# Altium project FEEL-Lora-STM32-Road-datalogger.PrjPcb
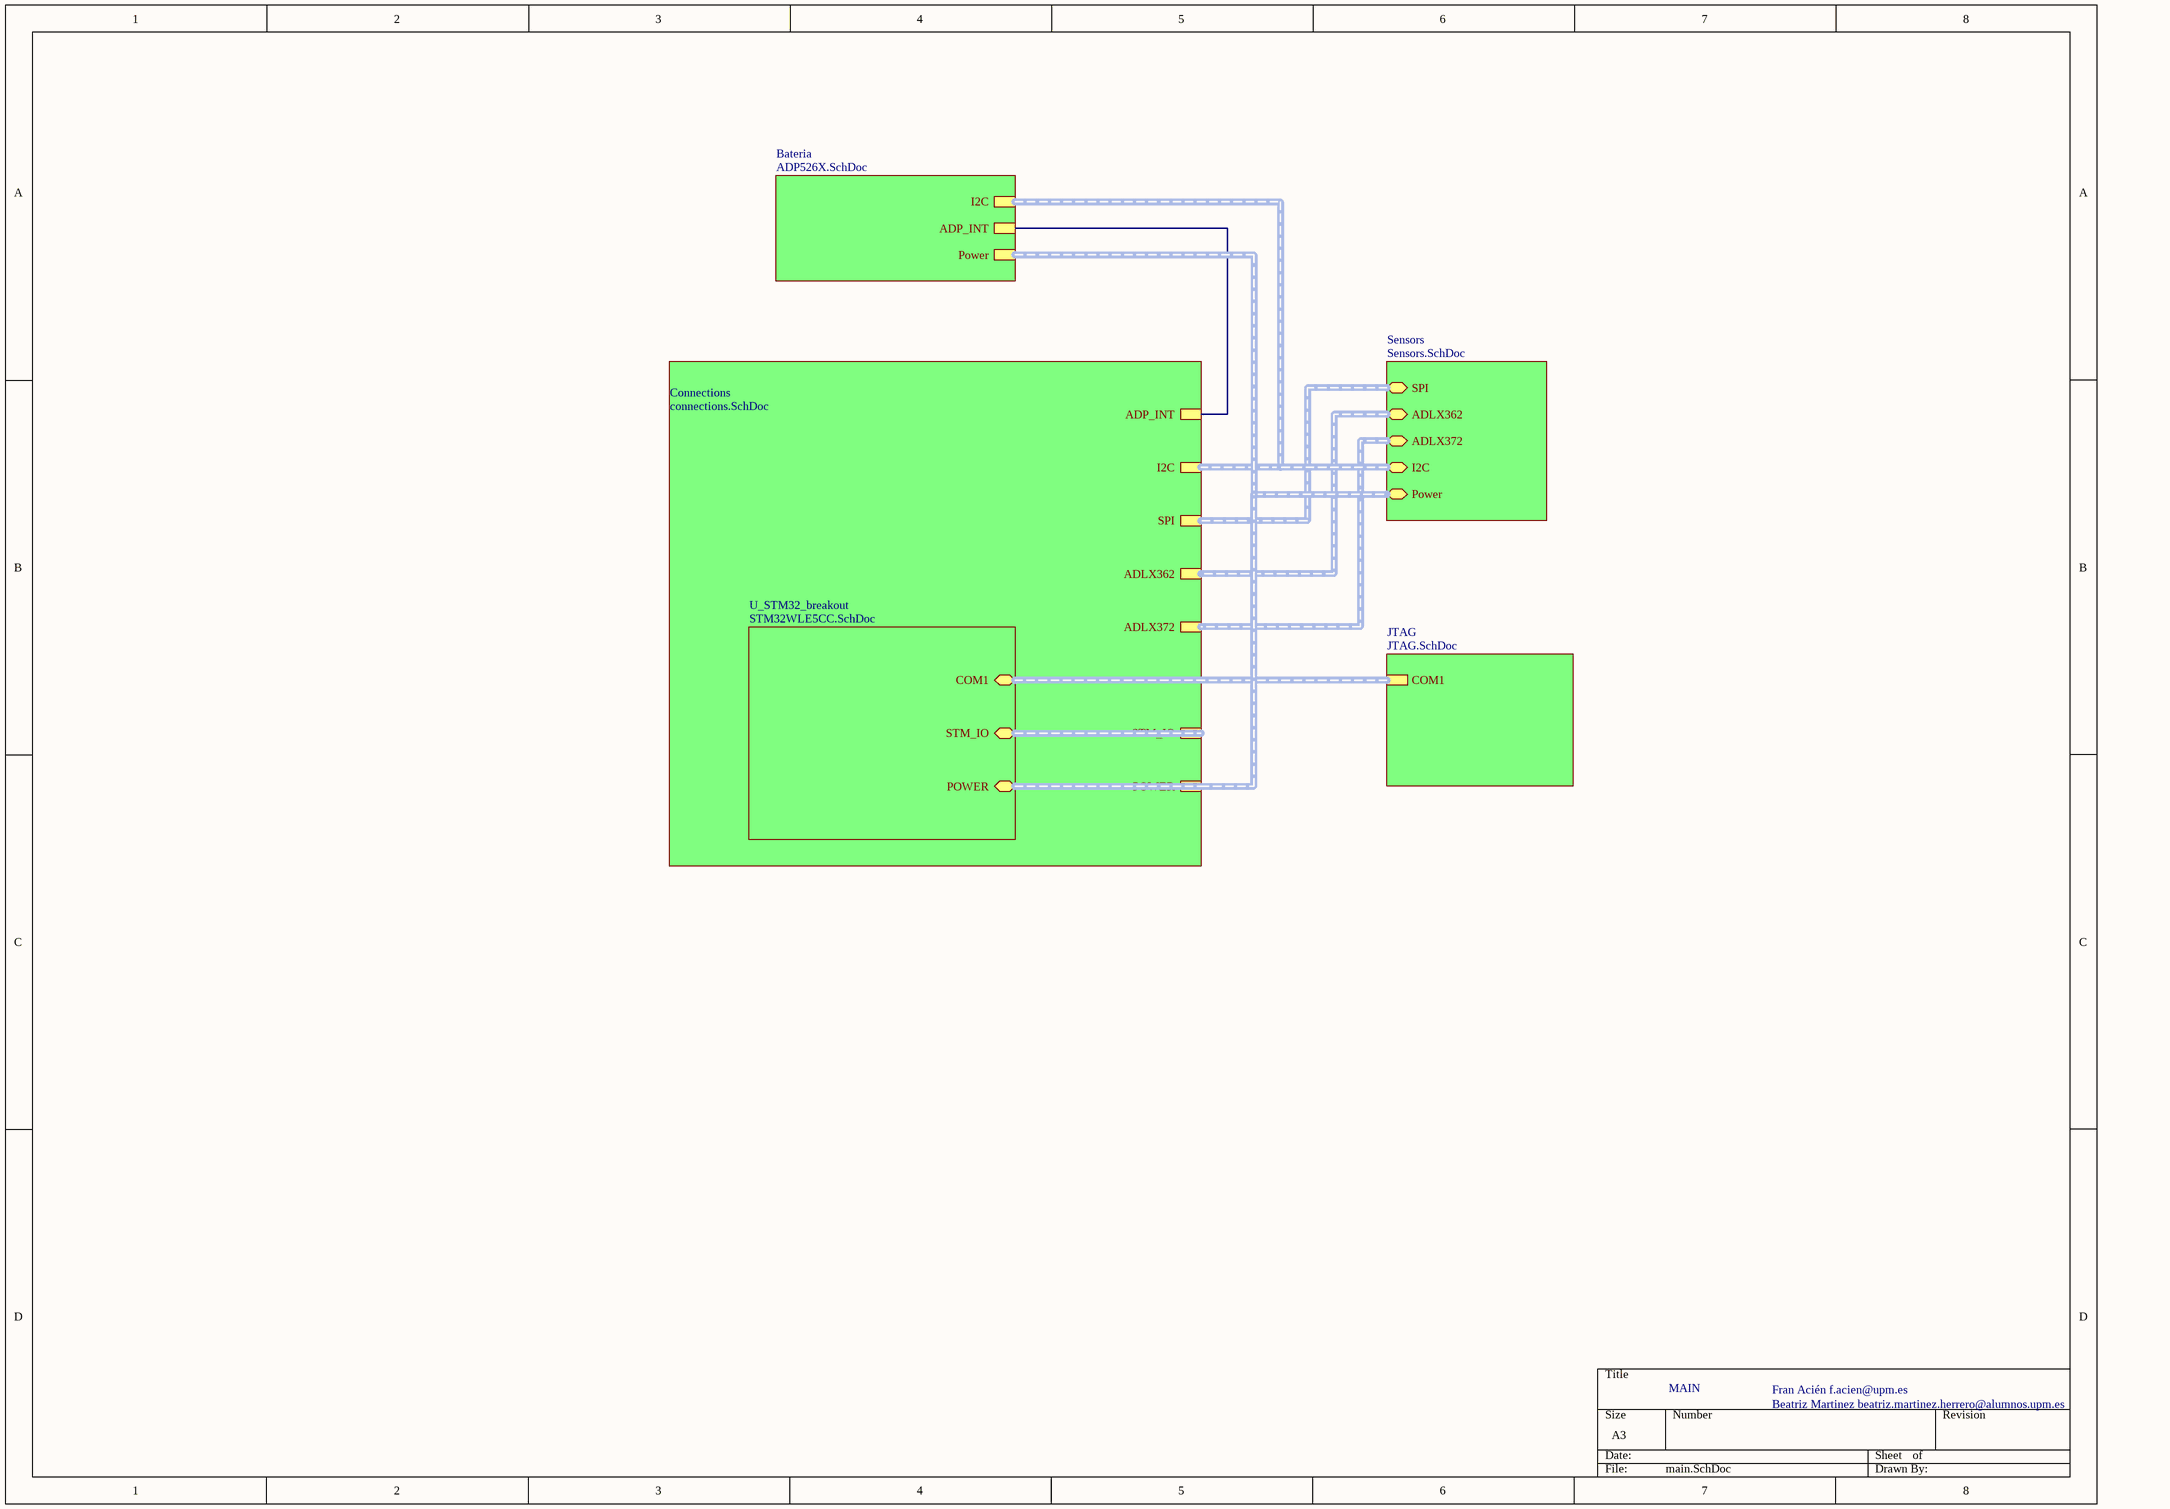
[diagram p0: main.SchDoc]
6 sheets, 77 parts. Net scope: hierarchical (ports join the sheet entries above them; power ports are global).
Board file: FOOTPRINT.PcbDoc
Sheets:
  main.SchDoc
    Connections = connections.SchDoc
    U_STM32_breakout = STM32WLE5CC.SchDoc
    Sensors = Sensors.SchDoc
    JTAG = JTAG.SchDoc
    Bateria = ADP526X.SchDoc

## Sheet main.SchDoc
size A3

### Sub-sheets
Bateria = ADP526X.SchDoc: I2C (harness I2C), Power (harness Power), ADP_INT
Connections = connections.SchDoc: I2C (harness I2C), SPI (harness SPI), ADLX362 (harness ADLX362), ADLX372 (harness ADLX372), STM_IO, POWER (harness Power), ADP_INT
JTAG = JTAG.SchDoc: COM1 (harness SWD)
Sensors = Sensors.SchDoc: SPI (bidir, harness SPI), ADLX362 (bidir, harness ADLX362), ADLX372 (bidir, harness ADLX372), I2C (bidir, harness BME680), Power (bidir, harness Power)
U_STM32_breakout = STM32WLE5CC.SchDoc: STM_IO (bidir, harness IO), COM1 (bidir, harness SWD), POWER (bidir, harness Power)

### Nets
ADP_INT: sheet Connections/ADP_INT, sheet Bateria/ADP_INT

### Buses and harness runs
harness sheet Bateria/I2C = sheet Connections/I2C = sheet Sensors/I2C
harness sheet Bateria/Power = sheet Connections/POWER = sheet Sensors/Power = sheet U_STM32_breakout/POWER
harness sheet Connections/ADLX362 = sheet Sensors/ADLX362
harness sheet Connections/ADLX372 = sheet Sensors/ADLX372
harness sheet Connections/SPI = sheet Sensors/SPI
harness sheet Connections/STM_IO = sheet U_STM32_breakout/STM_IO
harness sheet JTAG/COM1 = sheet U_STM32_breakout/COM1

### Notes on the sheet
- MAIN
- Fran Acién f.acien@upm.es
- Beatriz Martinez beatriz.martinez.herrero@alumnos.upm.es

## Sheet connections.SchDoc
size A4
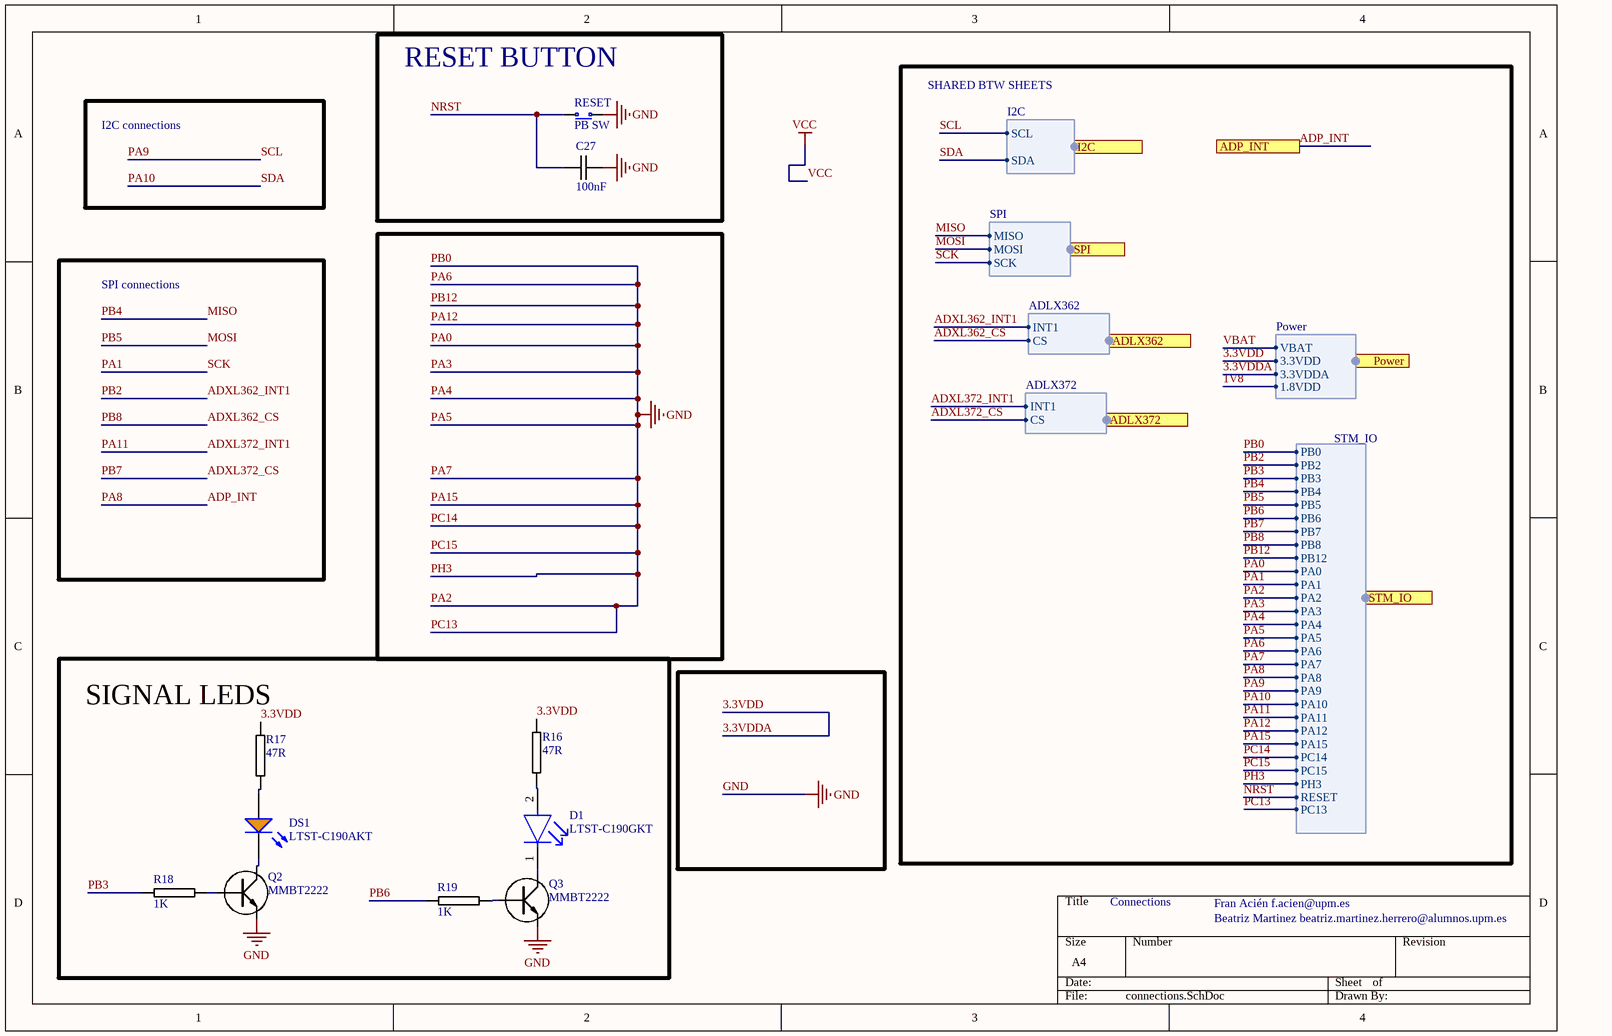
[diagram p1: connections.SchDoc]

### Parts
C27  100nF  [0603C-GENERIC]
D1  LTST-C190GKT  [FP-LTST-C190GKT-MFG]
DS1  LTST-C190AKT  [LTST-C190AKT-2_V]
Q2  MMBT2222  [SOT23-BCE]
Q3  MMBT2222  [SOT23-BCE]
R16  47R  [0603R-47]
R17  47R  [0603R-47]
R18  1K  [0603R-1k]
R19  1K  [0603R-1k]
RESET  PB SW  [Switch-PB-6.2x6.3mm-SMD]

### Blocks framed on the sheet
RESET BUTTON: C27 RESET
SIGNAL LEDS: D1 DS1 Q2 Q3 R16-R19

### Ports
ADLX362 (harness ADLX362), ADLX372 (harness ADLX372), ADP_INT, I2C (harness I2C), Power (harness Power), SPI (harness SPI), STM_IO (harness STM_IO)

### Harnesses
Power: VBAT, 3.3VDD, 3.3VDDA, 1.8VDD
SPI: MISO, MOSI, SCK
I2C: SCL, SDA
STM_IO: PB2, PB3, PB4, PB5, PB6, PB7, PB8, PB12, PA0, PA1, PA2, PA3, PA4, PA5, PA6, PA7, PA8, PA9, PA10, PA11, PA12, PA15, PC14, PC15, PB0, PH3, RESET, PC13
ADLX372: INT1, CS
ADLX362: INT1, CS

### Nets
3.3VDD: R16.1 R17.2 ; port Power.3.3VDD, port Power.3.3VDDA  [also labelled 3.3VDDA]
GND: C27.2 Q2.E Q3.E RESET.2(COM) ; port STM_IO.PB12, port STM_IO.PA0, port STM_IO.PA2, port STM_IO.PA3, port STM_IO.PA4, port STM_IO.PA5, port STM_IO.PA6, port STM_IO.PA7, port STM_IO.PA12, port STM_IO.PA15, port STM_IO.PC14, port STM_IO.PC15, port STM_IO.PB0, port STM_IO.PH3, port STM_IO.PC13  [also labelled PA0, PA12, PA15, PA2, PA3, PA4, PA5, PA6, PA7, PB0, PB12, PC13, PC14, PC15, PH3]
ADP_INT: port ADP_INT, port STM_IO.PA8  [also labelled PA8]
ADXL362_CS: port STM_IO.PB8, port ADLX362.CS  [also labelled PB8]
ADXL362_INT1: port STM_IO.PB2, port ADLX362.INT1  [also labelled PB2]
ADXL372_CS: port STM_IO.PB7, port ADLX372.CS  [also labelled PB7]
ADXL372_INT1: port STM_IO.PA11, port ADLX372.INT1  [also labelled PA11]
MISO: port SPI.MISO, port STM_IO.PB4  [also labelled PB4]
MOSI: port SPI.MOSI, port STM_IO.PB5  [also labelled PB5]
NRST: C27.1 RESET.1(N.O) ; port STM_IO.RESET
PA1: port SPI.SCK, port STM_IO.PA1  [also labelled SCK]
PA9: port I2C.SCL, port STM_IO.PA9  [also labelled SCL]
PA10: port I2C.SDA, port STM_IO.PA10  [also labelled SDA]
PB3: R18.1 ; port STM_IO.PB3
PB6: R19.1 ; port STM_IO.PB6
NetD1_1: D1.1(C) Q3.C
NetD1_2: D1.2(A) R16.2
NetDS1_1: DS1.1(A) R17.1
NetDS1_2: DS1.2(K) Q2.C
NetQ2_B: Q2.B R18.2
NetQ3_B: Q3.B R19.2

### Notes on the sheet
- SHARED BTW SHEETS
- I2C connections
- SPI connections
- Connections
- Fran Acién f.acien@upm.es
- Beatriz Martinez beatriz.martinez.herrero@alumnos.upm.es

### Library data of the parts
C27 = 0603C-100NF-50V-X7R-TDK: CAPACITOR 0603 CERAMIC; Manufacturer Part Number: C1608X7R1H103K; Manufacturer: TDK Corporation; Temperature Coefficient: X7R; Tolerance: ±10%; Voltage - Rated: 50V; Capacitance: 10000pF; Reel: C68; RoHS: RoHS Compliant; Lead Spacing: -; Package / Case: 0603 (1608 metric); Features: General Purpose; Packaging: Tape & Reel (TR); Thickness: 0.80mm; Operating Temperature: -55°C ~ 125°C; Mounting Type: Surface Mount, MLCC; Category: Capacitors; Supplier 1: Digi-Key; Supplier Part Number 1: 445-1314-2-ND
D1 = CMP-22017-000005-1: LED GREEN CLEAR CHIP SMD; Reverse Voltage: 5V; Power Dissipation: 100mW; Forward Voltage: 2.1V; Test Current: 10mA; Number of LEDs: 1; Viewing Angle: 130°; Forward Current: 30mA; Voltage: 2V; Wavelength: 565nm; Dominant Wavelength: 569nm; Luminous Intensity: 6mcd; Lens Color: Colorless; Packaging: Tape and Reel; Lens Transparency: Clear; Min Operating Temperature: -55°C; Case Code (Metric): 1608; Lens Style: Clear; Case/Package: 0603; Mount: Surface Mount; Package Quantity: 1; Height: 0.8mm; Illumination Color: Green; Radiation Hardening: No; Depth: 0.8mm; Number of Pins: 2; Max Operating Temperature: 85°C; Color: Green; Number of Elements: 1; Power Rating: 100mW; Case Code (Imperial): 0603; Width: 0.8mm; Length: 1.6mm; Lead Free: Lead Free
DS1 = CMP-1674-00006-1: Single Color Chip LED, 2.1 V, 2 mcd, -55 to 85 degC, 2-Pin SMD, RoHS, Tape and Reel; PackageDescription: 2-Pin Surface Mount Device, Body 1.6 x 0.8 mm; ComponentLink1URL: http://www.us.liteon.com/; ComponentLink1Description: Manufacturer URL; PackageReference: LTST-C190AKT-2; ComponentLink2Description: Datasheet; DatasheetVersion: Jan-03; ComponentLink2URL: http://datasheet.octopart.com/LTST-C190AKT-Lite-On-datasheet-11729267.pdf
Q2 Q3 = MMBT2222: BC847 SMALL SIGNAL NPN TRANSISTOR; Supplier 1: Digi-Key; Supplier Part Number 1: MMBT2222A-FDICT-ND
R16 R17 = 0603R-47R: GENERIC RESISTOR 0603; Manufacturer Part Number: RMC 1/16 47 1% R; Manufacturer: Stackpole Electronics Inc; Power (Watts): 0.1W, 1/10W; Temperature Coefficient: ±100ppm/°C; Resistance In Ohms: 47.0; Tolerance: ±1%; Supplier 1: Digi-Key; Supplier Part Number 1: RMC1/1647FR-ND; Supplier Part Number: RMC1/1647FR-ND; Category: Resistors; Case: 0603 (1608 metric); Packaging: Tape & Reel (TR); Lead Style: Surface Mount (SMD - SMT); RoHS: RoHS Compliant; Supplier: Digi-Key; Composition: Thick Film
R18 R19 = 0603R-1K: GENERIC RESISTOR 0603; Manufacturer Part Number: RMCF 1/16 1K 1% R; Manufacturer: Stackpole Electronics Inc; Reel: R14; Supplier 1: Digi-Key; Supplier Part Number 1: RMCF0603FT1K00TR-ND
RESET = TS604VM1-025BR-R: Tactile Switch, SPNO, SMD, 160gf, 6.2x6.3x2.5mm; Manufacturer: Dailywell; Part number IPS: 00000007812; Artikkelnr Noca: 50019106; Part Number: Switch-PB-6.2x6.3mm-SMD; Manufacturer Part Number: TS604VM1-025BR-R; Footprint Doc: Switch-PB-6.2x6.3mm-SMD; LatestRevisionDate: 2016-04-21; Pin Count: 4; Publisher: Nordic Semiconductor; Published: 2010-02-01; Value: PB SW; Note: *; ComponentLink1URL: *; ComponentLink1Description: Datasheet; ComponentLink2URL: *; ComponentLink2Description: Supplier link; HelpURL: \\hizz\pro\app9717\Datasheet\switches\Dailywell\TS604VM1-025BR-R.pdf; Supplier 1: Cabcon; Supplier Part Number 1: TS604VM1-025BR-R; Supplier 2: Mouser; Supplier Part Number 2: 688-SKHUALE010

## Sheet STM32WLE5CC.SchDoc
size A3
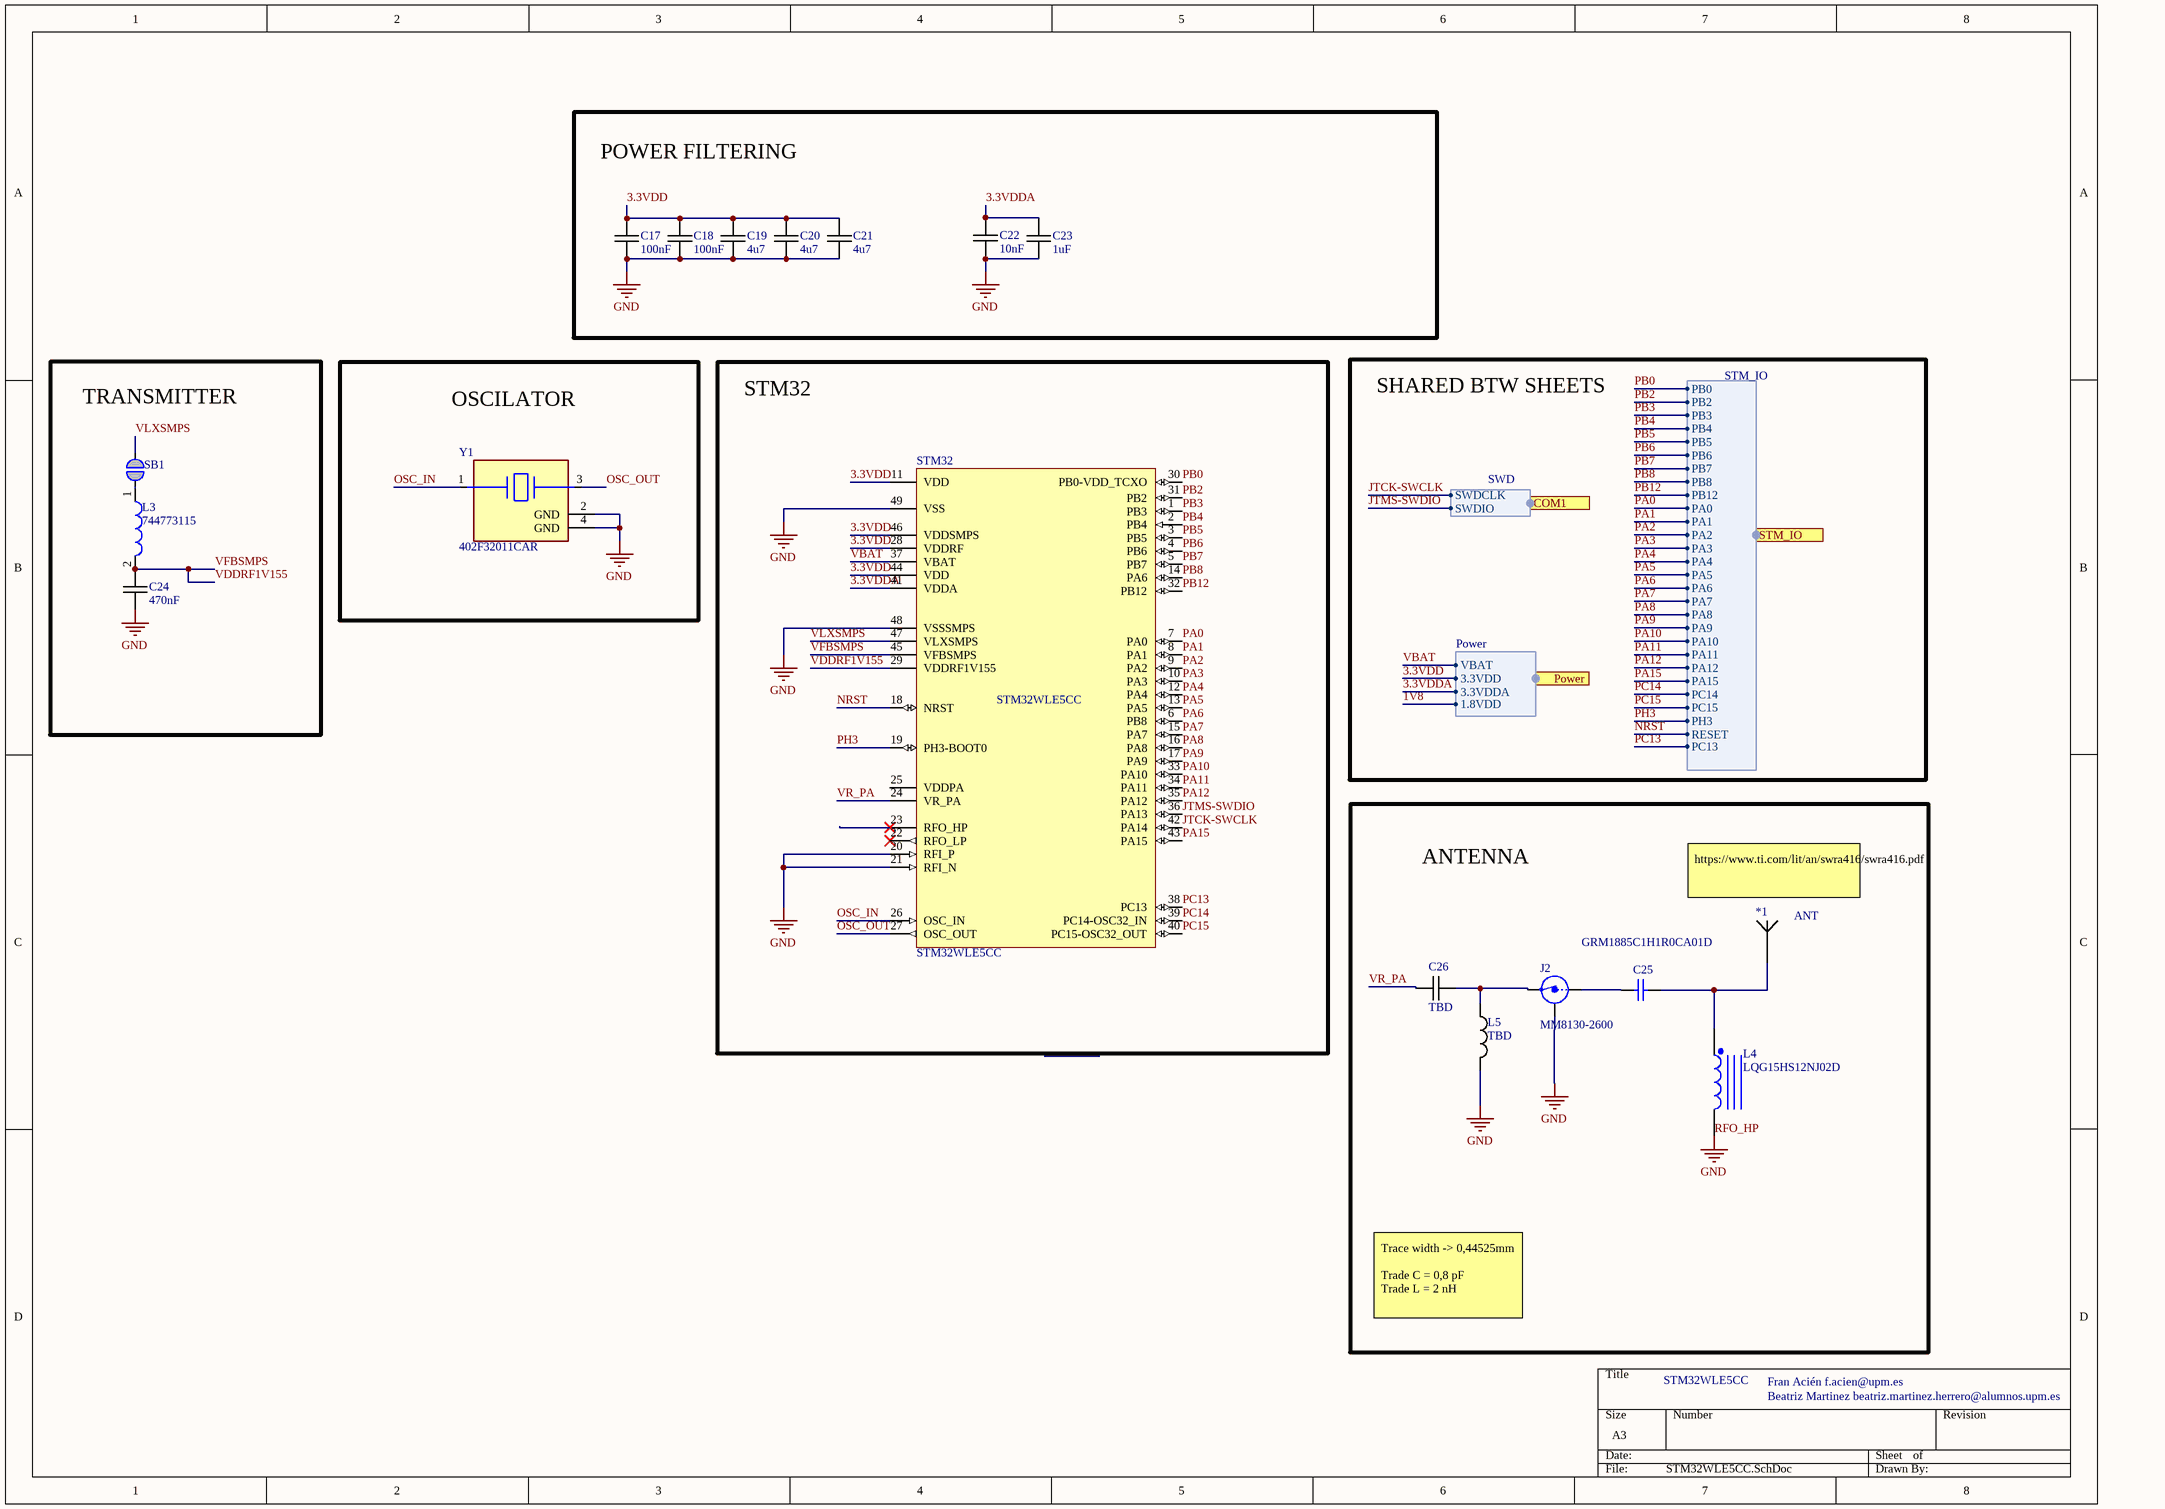
[diagram p2: STM32WLE5CC.SchDoc]

### Parts
*1  ANT
C17  100nF  [0603C-GENERIC]
C18  100nF  [0603C-GENERIC]
C19  4u7  [0603C-GENERIC]
C20  4u7  [0603C-GENERIC]
C21  4u7  [0603C-GENERIC]
C22  10nF  [0603C-GENERIC]
C23  1uF  [0603C-GENERIC]
C24  470nF  [0603C-GENERIC]
C25  GRM1885C1H1R0CA01D  [CAPC1608X90X35NL10T15]
C26  TBD  [0603C-GENERIC]
J2  MM8130-2600  [COAXIAL-SWF]
L3  744773115  [WE-PD2-S]
L4  LQG15HS12NJ02D  [INDC1005X55X25LL05T10_A]
L5  TBD  [0402C-TBD]
SB1  Solderbridge  [Solderbridge]  (value not drawn)  (no BOM)
STM32  STM32WLE5CC  [stm32wle5cc]
Y1  402F32011CAR  [FP-402-MFG]

### Blocks framed on the sheet
POWER FILTERING: C17-C23
TRANSMITTER: C24 L3 SB1
OSCILATOR: Y1
STM32: STM32
ANTENNA: *1 C25 C26 J2 L4 L5

### Ports
COM1 (harness SWD), Power (harness Power), STM_IO (harness STM_IO)

### Harnesses
STM_IO: PB2, PB3, PB4, PB5, PB6, PB7, PB8, PB12, PA0, PA1, PA2, PA3, PA4, PA5, PA6, PA7, PA8, PA9, PA10, PA11, PA12, PA15, PC14, PC15, PB0, PH3, RESET, PC13
SWD: SWDCLK, SWDIO
Power: VBAT, 3.3VDD, 3.3VDDA, 1.8VDD

### Nets
3.3VDD: C17.1 C18.1 C19.1 C20.1 C21.1 C22.1 C23.1 STM32.11(VDD) STM32.28(VDDRF) STM32.41(VDDA) STM32.44(VDD) STM32.46(VDDSMPS) ; port Power.3.3VDD, port Power.3.3VDDA  [also labelled 3.3VDDA]
GND: C17.2 C18.2 C19.2 C20.2 C21.2 C22.2 C23.2 C24.2 J2.2(Shield) L4.2 L5.2 STM32.6(PB8) STM32.7(PA0) STM32.9(PA2) STM32.10(PA3) STM32.12(PA4) STM32.13(PA5) STM32.15(PA7) STM32.19(PH3-BOOT0) STM32.20(RFI_P) STM32.21(RFI_N) STM32.30(PB0-VDD_TCXO) STM32.32(PB12) STM32.35(PA12) STM32.38(PC13) STM32.39(PC14-OSC32_IN) STM32.40(PC15-OSC32_OUT) STM32.43(PA15) STM32.48(VSSSMPS) STM32.49(VSS) Y1.2(GND) Y1.4(GND) ; port STM_IO.PB12, port STM_IO.PA0, port STM_IO.PA2, port STM_IO.PA3, port STM_IO.PA4, port STM_IO.PA5, port STM_IO.PA6, port STM_IO.PA7, port STM_IO.PA12, port STM_IO.PA15, port STM_IO.PC14, port STM_IO.PC15, port STM_IO.PB0, port STM_IO.PH3, port STM_IO.PC13  [also labelled PA0, PA12, PA15, PA2, PA3, PA4, PA5, PA6, PA7, PB0, PB12, PC13, PC14, PC15, PH3, RFO_HP]
VBAT: STM32.37(VBAT) ; port Power.VBAT  [project net BSNS]
JTCK-SWCLK: STM32.42(PA14) ; port COM1.SWDCLK
JTMS-SWDIO: STM32.36(PA13) ; port COM1.SWDIO
NRST: STM32.18(NRST) ; port STM_IO.RESET
OSC_IN: STM32.26(OSC_IN) Y1.1
OSC_OUT: STM32.27(OSC_OUT) Y1.3
PA1: STM32.8(PA1) ; port STM_IO.PA1
PA8: STM32.16(PA8) ; port STM_IO.PA8  [project net ADP_INT]
PA9: STM32.17(PA9) ; port STM_IO.PA9
PA10: STM32.33(PA10) ; port STM_IO.PA10
PA11: STM32.34(PA11) ; port STM_IO.PA11  [project net ADXL372_INT1]
PB2: STM32.31(PB2) ; port STM_IO.PB2  [project net ADXL362_INT1]
PB3: STM32.1(PB3) ; port STM_IO.PB3
PB4: STM32.2(PB4) ; port STM_IO.PB4  [project net MISO]
PB5: STM32.3(PB5) ; port STM_IO.PB5  [project net MOSI]
PB6: STM32.4(PB6) ; port STM_IO.PB6
PB7: STM32.5(PB7) ; port STM_IO.PB7  [project net ADXL372_CS]
PB8: STM32.14(PA6) ; port STM_IO.PB8  [project net ADXL362_CS]
VDDRF1V155: C24.1 L3.2 STM32.29(VDDRF1V155) STM32.45(VFBSMPS)  [also labelled VFBSMPS]
VLXSMPS: SB1.1 STM32.47(VLXSMPS)
VR_PA: C26.1 STM32.24(VR_PA)
Net*1_1: *1.1 C25.2 L4.1
NetC25_1: C25.1 J2.1(IN)
NetC26_2: C26.2 J2.3(OUT) L5.1
NetL3_1: L3.1 SB1.2

Not connected (* = marked no-connect by the designer): STM32 22(RFO_LP)* 23(RFO_HP)* 25(VDDPA)

### Notes on the sheet
- SHARED BTW SHEETS
- https://www.ti.com/lit/an/swra416/swra416.pdf
- Trace width -> 0,44525mm
  Trade C = 0,8 pF
  Trade L = 2 nH
- STM32WLE5CC
- Fran Acién f.acien@upm.es
- Beatriz Martinez beatriz.martinez.herrero@alumnos.upm.es

### Library data of the parts
C17 C18 = 0603C-100NF-50V-X7R-TDK: as C27 on sheet connections; RoHS: RoHS Compliant; Lead Spacing: -; Package / Case: 0603 (1608 metric); Features: General Purpose; Packaging: Tape & Reel (TR); Thickness: 0.80mm; Operating Temperature: -55°C ~ 125°C; Mounting Type: Surface Mount, MLCC; Category: Capacitors; Supplier 1: Digi-Key; Supplier Part Number 1: 445-1314-2-ND
C19-C21 = 0603C-4U7-6V3-X5R-KEM: CAPACITOR 0603 CERAMIC; Reel: C36
C22 = 0603C-10NF-50V-X7R-MUR: CAPACITOR 0603 CERAMIC; Manufacturer Part Number: GRM188R71H103KA01D; Manufacturer: Murata Electronics North America; Reel: C22; Supplier 1: Digi-Key; Supplier Part Number 1: 490-1512-2-ND
C23 = 0603C-1UF-25V-X5R-SAM: CAPACITOR 0603 CERAMIC; Reel: C17
C24 = 0603C-470NF-25V-X7R-MUR: CAPACITOR 0603 CERAMIC; Manufacturer: Murata Electronics North America; Manufacturer Part Number: GRM188R71E474KA12D; Reel: C14; Temperature Coefficient: X7R; Capacitance: 0.47µF; Voltage - Rated: 25V; Tolerance: ±10%; Supplier 1: Digi-Key; RoHS: RoHS Compliant; Features: General Purpose; Operating Temperature: -55°C ~ 125°C; Packaging: Tape & Reel (TR); Thickness: 0.80mm; Mounting Type: Surface Mount, MLCC; Lead Spacing: -; Category: Capacitors; Package / Case: 0603 (1608 metric); Supplier: Digi-Key; Supplier Part Number 1: 490-3291-2-ND; Supplier Part Number: 490-3291-2-ND
C25 = CMP-2006-02464-1: Manufacturer: Murata; Part Number: GRM1885C1H1R0CA01D
C26 = 0603C-000: CAPACITOR 0603 CERAMIC
J2 = MM8130-2600: Coaxial Connector with Switch; Manufacturer: Murata; Part number IPS: 00000009955; Artikkelnr Noca: 55029011; Part Number: MM8130-2600; Manufacturer Part Number: MM8130-2600; LatestRevisionDate: 2014-04-24; Pin Count: 3; Publisher: Nordic Semiconductor; Published: 2014-04-24; Value: MM8130-2600; Note: *; Footprint Doc: COAXIAL-SWF; ComponentLink1URL: *; ComponentLink1Description: Datasheet; ComponentLink2URL: *; ComponentLink2Description: Supplier link; HelpURL: http://www.murata.com/products/catalog/pdf/o33e.pdf; Supplier 1: Digi-Key; Supplier Part Number 1: 490-4981-1-ND; Supplier 2: Mouser; Supplier Part Number 2: 81-MM8130-2600RA2
L3 = CMP-0227-00515-1: SMD Power Inductor WE-PD2, L = 15.0 µH; Inductance: 15.0 ÂµH; PackageDescription: SMD Inductor, 2-Leads, Body 4.5 x 4.0 mm; PackageVersion: 2004; ComponentLink1Description: Manufacturer Link; ComponentLink2Description: Datasheet; PackageReference: WE-PD2-S; ComponentLink2URL: http://www.we-online.de/katalog/media/pdf/744773115.pdf; ComponentLink1URL: http://www.we-online.com; DatasheetVersion: ver 1, Oct-2004
L4 = CMP-2000-06576-1: Chip Inductor, 12 nH, +/-5%, 300 mA, -55 to 125 degC, 0402 (1005 Metric), RoHS, Tape and Reel; Manufacturer: Murata; Inductance-Nom: 12nH; Rated Current-Max: 300mA; Tolerance (%): ±5%; DC Resistance: 0.28O; Datasheet Version: 09/2010; Manufacturer URL: http://www.murata.com/; Package Reference: 0402; Case Size/Dimension: 0402; Datasheet URL: http://search.murata.co.jp/Ceramy/image/img/PDF/ENG/L0075S0083LQG15HS.pdf; Mounting Technology: SurfaceMount; Package Description: 2-Pin Surface Mount Device, Body 1 x 0.5 mm
L5 = INDUCTOR
SB1 = SOLDERBRIDGE: Artikkelnr Noca: N.A.; Part Number: Solderbridge; Manufacturer: *; Manufacturer Part Number: *; ComponentLink1URL: *; ComponentLink1Description: Datasheet; ComponentLink2URL: *; ComponentLink2Description: Supplier link; HelpURL: *; Footprint Doc: Solderbridge; LatestRevisionDate: 2009-12-14; Pin Count: 2; Publisher: Nordic Semiconductor; Published: 2009-12-14; Value: Solderbridge; Note: *; Supplier 1: *; Supplier Part Number 1: *; Supplier 2: *; Supplier Part Number 2: *; Part number IPS: N.A.
STM32 = STM32WLE5CC: Ultra-low power multi-modulation wireless STM32WLE5 microcontrollers
Y1 = CMP-06858-000005-1: CRYSTAL 32.0000MHZ 10PF SMD; Frequency Tolerance: 10ppm; Frequency: 32MHz; Series Resistance: 100R; Width: 0.063inch; Height: 0.022inch; Length: 0.079inch; Contact Plating: Gold; Package Quantity: 3000; Case/Package: SMD/SMT; Frequency Stability: 10ppm; ESR (Equivalent Series Resistance): 100R; Min Operating Temperature: -20°C; Tolerance: 10ppm; Load Capacitance: 10pF; Packaging: Tape and Reel; Max Operating Temperature: 70°C; Mount: Surface Mount; Termination: SMD/SMT

## Sheet Sensors.SchDoc
size A4
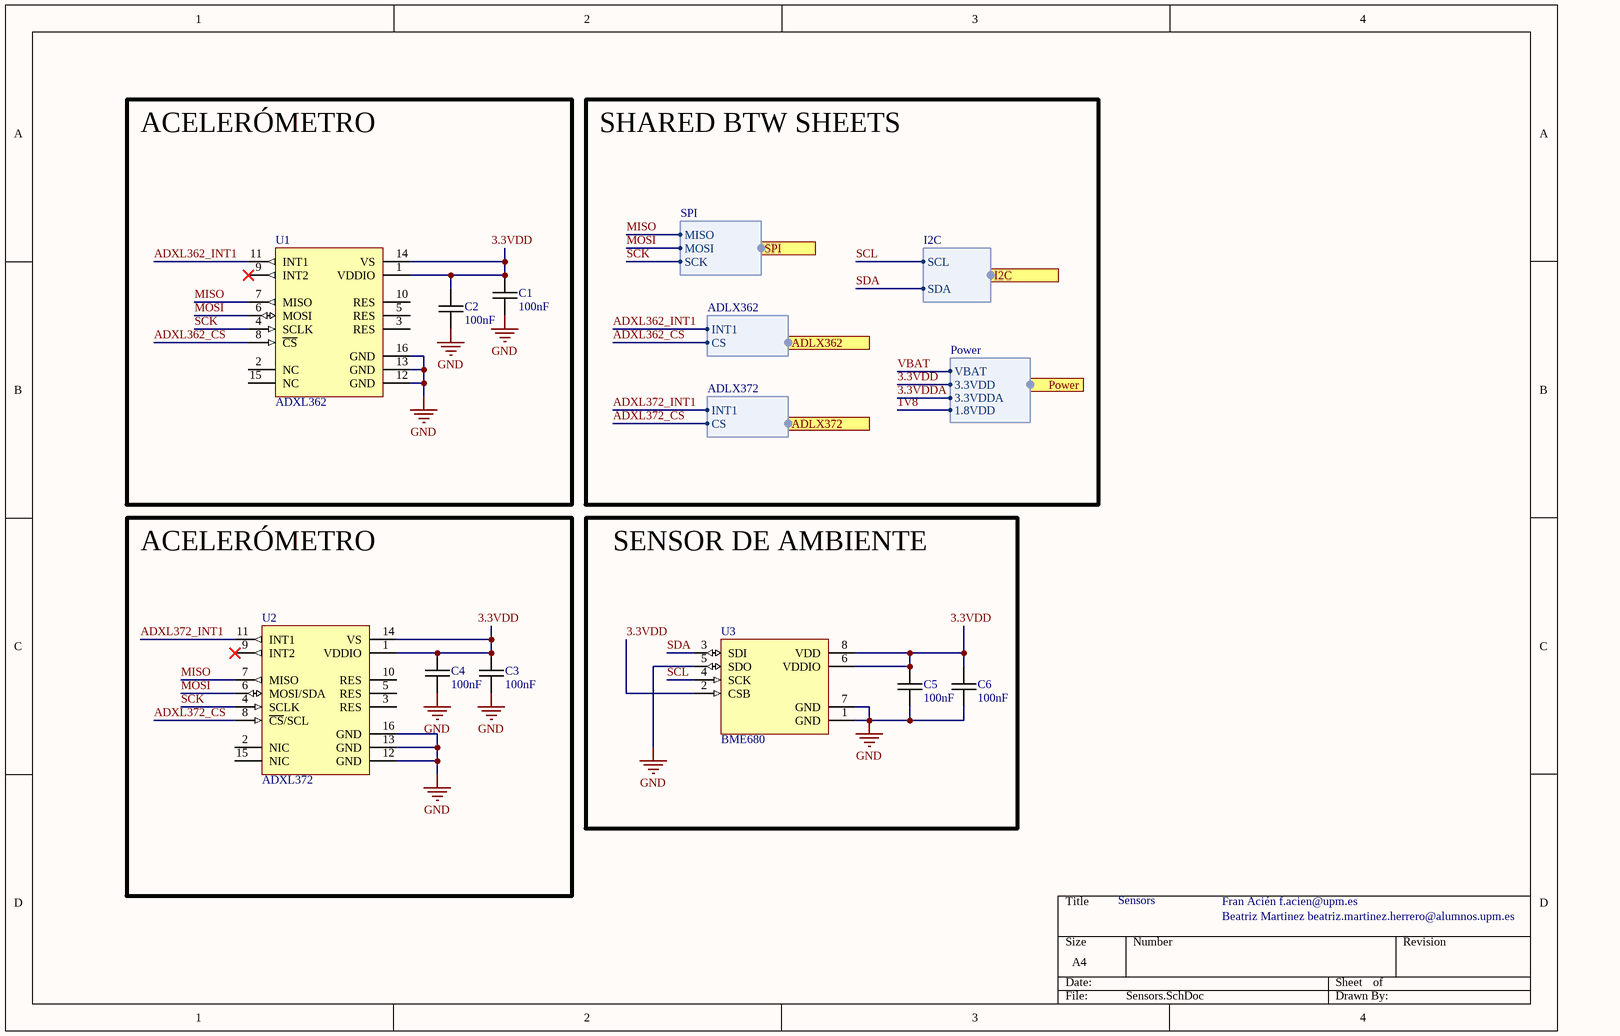
[diagram p3: Sensors.SchDoc]

### Parts
C1  100nF  [0603C-GENERIC]
C2  100nF  [0603C-GENERIC]
C3  100nF  [0603C-GENERIC]
C4  100nF  [0603C-GENERIC]
C5  100nF  [0603C-GENERIC]
C6  100nF  [0603C-GENERIC]
U1  ADXL362  [LGA50P322X300X114-16N]
U2  ADXL372  [LGA50P322X300X114-16N]
U3  BME680  [BME680]

### Blocks framed on the sheet
ACELERÓMETRO: C1 C2 U1
ACELERÓMETRO: C3 C4 U2
SENSOR DE AMBIENTE: C5 C6 U3

### Ports
ADLX362 (harness ADLX362), ADLX372 (harness ADLX372), I2C (harness I2C), Power (harness Power), SPI (harness SPI)

### Harnesses
ADLX372: INT1, CS
ADLX362: INT1, CS
Power: VBAT, 3.3VDD, 3.3VDDA, 1.8VDD
I2C: SCL, SDA
SPI: MISO, MOSI, SCK

### Nets
3.3VDD: U3.2(CSB) ; port Power.3.3VDD, port Power.3.3VDDA  [also labelled 3.3VDDA]
GND: C1.2 C2.2 C3.2 C4.2 C5.2 C6.2 U1.12(GND) U1.13(GND) U1.16(GND) U2.12(GND) U2.13(GND) U2.16(GND) U3.1(GND) U3.5(SDO) U3.7(GND)
ADXL362_CS: U1.8(~{CS}) ; port ADLX362.CS
ADXL362_INT1: U1.11(INT1) ; port ADLX362.INT1
ADXL372_CS: U2.8(~{CS}/SCL) ; port ADLX372.CS
ADXL372_INT1: U2.11(INT1) ; port ADLX372.INT1
MISO: U1.7(MISO) U2.7(MISO) ; port SPI.MISO
MOSI: U1.6(MOSI) U2.6(MOSI/SDA) ; port SPI.MOSI
SCK: U1.4(SCLK) U2.4(SCLK) ; port SPI.SCK  [project net PA1]
SCL: U3.4(SCK) ; port I2C.SCL  [project net PA9]
SDA: U3.3(SDI) ; port I2C.SDA  [project net PA10]
NetC1_1: C1.1 C2.1 U1.1(VDDIO) U1.14(VS)
NetC3_1: C3.1 C4.1 U2.1(VDDIO) U2.14(VS)
NetC5_1: C5.1 C6.1 U3.6(VDDIO) U3.8(VDD)

Not connected (* = marked no-connect by the designer): U1 2(NC) 3(RES) 5(RES) 9(INT2)* 10(RES) 15(NC); U2 2(NIC) 3(RES) 5(RES) 9(INT2)* 10(RES) 15(NIC)

### Notes on the sheet
- SHARED BTW SHEETS
- Sensors
- Fran Acién f.acien@upm.es
- Beatriz Martinez beatriz.martinez.herrero@alumnos.upm.es
- Labels drawn without touching a wire or pin: 3.3VDD

### Library data of the parts
C1-C6 = 0603C-100NF-50V-X7R-TDK: as C27 on sheet connections; RoHS: RoHS Compliant; Lead Spacing: -; Package / Case: 0603 (1608 metric); Features: General Purpose; Packaging: Tape & Reel (TR); Thickness: 0.80mm; Operating Temperature: -55°C ~ 125°C; Mounting Type: Surface Mount, MLCC; Category: Capacitors; Supplier 1: Digi-Key; Supplier Part Number 1: 445-1314-2-ND
U1 = ADXL362: Micropower, 3-Axis, ±2 g/±4 g/±8 g Digital Output MEMS Accelerometer; Manufacturer: Analog Devices; Part number IPS: 00000001799; Artikkelnr Noca: N.A.; Part Number: ADXL362; Manufacturer Part Number: ADXL362; ComponentLink1URL: http://www.analog.com/media/en/technical-documentation/data-sheets/ADXL362.pdf; ComponentLink1Description: Datasheet; ComponentLink2URL: http://www.analog.com/en/products/adxl362.html; ComponentLink2Description: Supplier link; HelpURL: https://www.analog.com/media/en/technical-documentation/data-sheets/ADXL362.pdf; Footprint Doc: LGA-16; LatestRevisionDate: 2019-01-11; Pin Count: 16; Publisher: Nordic Semiconductor; Published: 2019-01-11; Value: ADXL362; Note: *; Supplier 1: Digi-Key; Supplier Part Number 1: ADXL362BCCZ-RL7CT-ND; Supplier 2: Mouser; Supplier Part Number 2: 584-ADXL362BCCZ-R7
U2 = ADXL372: Micropower, 3-Axis, ±200g digital output acelerometer; Manufacturer: Analog Devices; Part number IPS: 00000001798; Artikkelnr Noca: N.A.; Part Number: ADXL372; Manufacturer Part Number: ADXL372; Footprint Doc: LGA-16; LatestRevisionDate: 2018-08-24; Pin Count: 16; Publisher: Nordic Semiconductor; Published: 2018-08-24; Value: ADXL372; Note: *; ComponentLink1URL: http://www.analog.com/media/en/technical-documentation/data-sheets/ADXL372.pdf; ComponentLink1Description: Datasheet; ComponentLink2URL: http://www.analog.com/en/products/adxl372.html; ComponentLink2Description: Supplier link; HelpURL: http://www.analog.com/en/products/adxl372.html; Supplier 1: Digi-Key; Supplier Part Number 1: ADXL372BCCZ-RL7CT-ND; Supplier 2: *; Supplier Part Number 2: *
U3 = BME680: Low power gas, pressure, temperature & humidity sensor; Manufacturer: Bosch; Part number IPS: 00000001800; Artikkelnr Noca: N.A.; Part Number: BME680; Manufacturer Part Number: BME680; Footprint Doc: LGA-8; LatestRevisionDate: 2018-05-24; Pin Count: 8; Publisher: Nordic Semiconductor; Published: 2018-05-24; Value: BME680; Note: *; ComponentLink1URL: https://ae-bst.resource.bosch.com/media/_tech/media/datasheets/BST-BME680-DS001-00.pdf; ComponentLink1Description: Datasheet; ComponentLink2Description: Supplier link; HelpURL: *; Supplier 1: Digi-Key; Supplier Part Number 1: 828-1077-1-ND; Supplier 2: *; Supplier Part Number 2: *

## Sheet JTAG.SchDoc
size A4
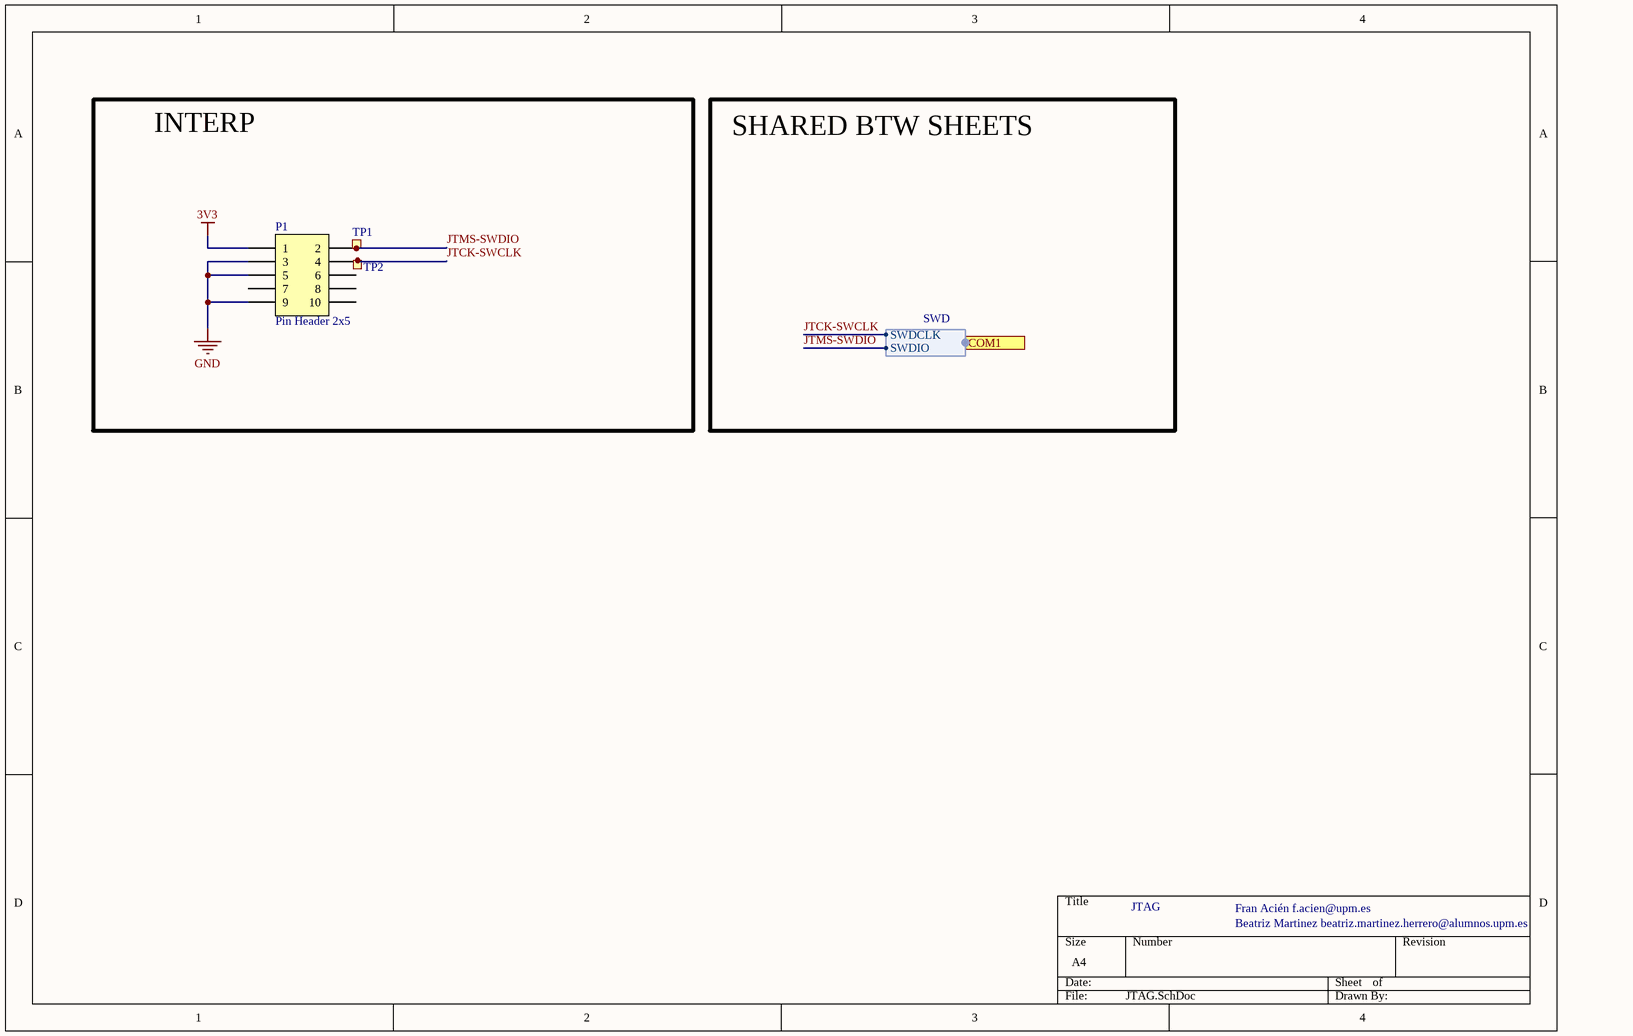
[diagram p4: JTAG.SchDoc]

### Parts
P1  Pin Header 2x5  [HDR_2x5-SMD-1.27mm-ANG]
TP1  Ø1.0mm,SMD  [TP_SMD_Ø1.0mm]  (value not drawn)  (no BOM)
TP2  Ø1.0mm,SMD  [TP_SMD_Ø1.0mm]  (value not drawn)  (no BOM)

### Blocks framed on the sheet
INTERP: P1 TP1 TP2

### Ports
COM1 (harness SWD)

### Harnesses
SWD: SWDCLK, SWDIO

### Nets
3V3: P1.1  [project net 3.3VDD]
GND: P1.3 P1.5 P1.9
JTCK-SWCLK: P1.4 TP2.1 ; port COM1.SWDCLK
JTMS-SWDIO: P1.2 TP1.1 ; port COM1.SWDIO

Not connected (* = marked no-connect by the designer): P1 6 7 8 10

### Notes on the sheet
- SHARED BTW SHEETS
- JTAG
- Fran Acién f.acien@upm.es
- Beatriz Martinez beatriz.martinez.herrero@alumnos.upm.es

### Library data of the parts
P1 = Pin Header 2x5 SMD, 1.27mm, Angled: Pin Header 2x5, 1.27mm (50mil); Manufacturer: Samtec; Manufacturer Part Number: FTSH-105-01-L-DH-A-C-TR; Part number IPS: 00000007800; Artikkelnr Noca: N.A.; Part Number: Pin Header 2x5 SMD, 1.27mm, Angled; LatestRevisionDate: 2014-01-22; Pin Count: 10; Publisher: Nordic Semiconductor; Published: 2014-01-22; Value: Pin Header 2x5; Note: *; Footprint Doc: HDR_2x5-SMD-1.27mm-ANG; ComponentLink1URL: *; ComponentLink1Description: Datasheet; ComponentLink2URL: *; ComponentLink2Description: Supplier link; HelpURL: http://www.samtec.com/documents/webfiles/pdf/FTSH_SMT.PDF; Supplier 1: Samtec; Supplier Part Number 1: FTSH-105-01-L-DH-A-C-TR; Supplier 2: *; Supplier Part Number 2: *
TP1 TP2 = TP_SMD_Ø1.0MM: 1.0mm circular SMD testpad; Manufacturer: Nordic Semiconductor; Artikkelnr Noca: N.A.; Part Number: TP_SMD_Ø1.0MM; Manufacturer Part Number: *; ComponentLink1URL: *; ComponentLink1Description: Datasheet; ComponentLink2URL: *; ComponentLink2Description: Supplier link; HelpURL: *; Footprint Doc: TP_SMD_Ø1.0mm; LatestRevisionDate: 2013-06-11; Pin Count: 1; Publisher: Nordic Semiconductor; Published: 2013-06-11; Value: Ø1.0mm,SMD; Note: *; Supplier 1: *; Supplier Part Number 1: *; Supplier 2: *; Supplier Part Number 2: *; Part number IPS: N.A.

## Sheet ADP526X.SchDoc
size A3
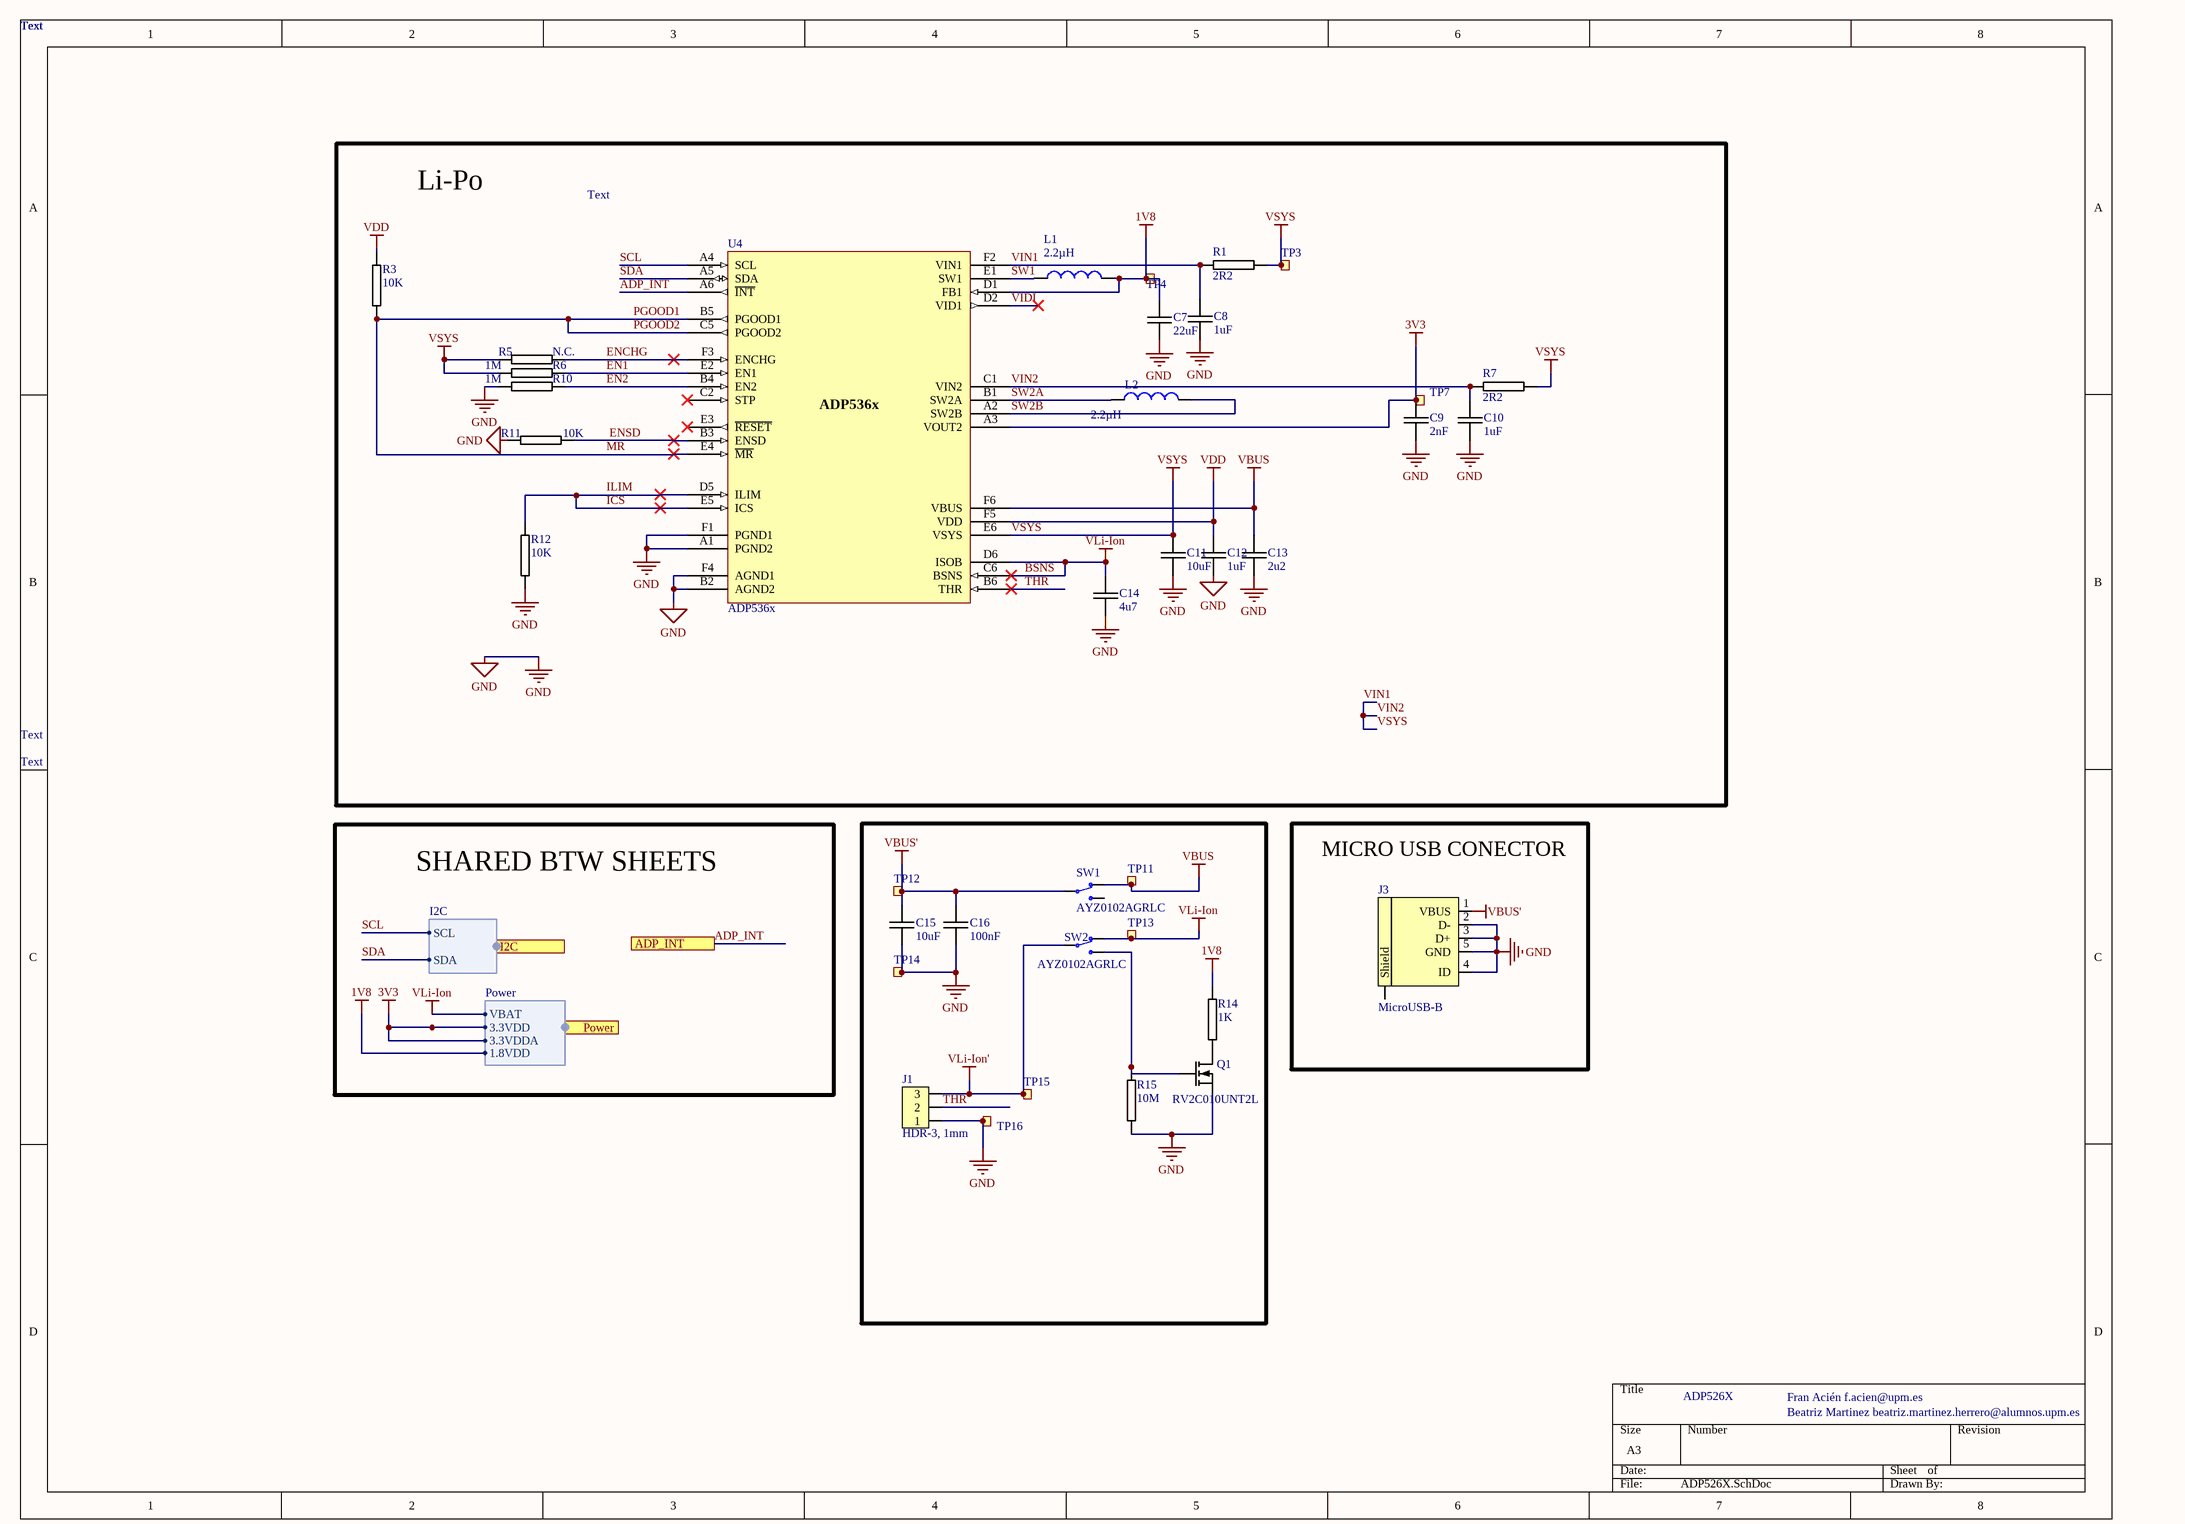
[diagram p5: ADP526X.SchDoc]

### Parts
C7  22uF  [0402C-TBD]
C8  1uF  [0402C-GENERIC]
C9  2nF  [0402C-TBD]
C10  1uF  [0402C-GENERIC]
C11  10uF  [0402C-GENERIC]
C12  1uF  [0402C-GENERIC]
C13  2u2  [0402C-GENERIC]
C14  4u7  [0402C-GENERIC]
C15  10uF  [0603C-GENERIC]
C16  100nF  [0603C-GENERIC]
J1  HDR-3, 1mm  [SM03B-SRSS-TB]
J3  MicroUSB-B  [USB-Micro-B-RA-SMD-PiP]
L1  2.2µH  [INDC2016X18N]
L2  2.2µH  [INDC2016X18N]
Q1  RV2C010UNT2L  [DFN65P100X40-3L]
R1  2R2  [0603R-GENERIC]
R3  10K  [0603R-10K]
R5  N.C.  [0603R-GENERIC]
R6  1M  [0603R-GENERIC]
R7  2R2  [0603R-GENERIC]
R10  1M  [0603R-GENERIC]
R11  10K  [0603R-10K]
R12  10K  [0603R-10K]
R14  1K  [0603R-1k]
R15  10M  [0603R-GENERIC]
SW1  AYZ0102AGRLC  [AYZ0102AGRLC]
SW2  AYZ0102AGRLC  [AYZ0102AGRLC]
TP3  Ø1.0mm,SMD  [TP_SMD_Ø1.0mm]  (value not drawn)  (no BOM)
TP4  Ø1.0mm,SMD  [TP_SMD_Ø1.0mm]  (value not drawn)  (no BOM)
TP7  Ø1.0mm,SMD  [TP_SMD_Ø1.0mm]  (value not drawn)  (no BOM)
TP11  Ø1.0mm,SMD  [TP_SMD_Ø1.0mm]  (value not drawn)  (no BOM)
TP12  Ø1.0mm,SMD  [TP_SMD_Ø1.0mm]  (value not drawn)  (no BOM)
TP13  Ø1.0mm,SMD  [TP_SMD_Ø1.0mm]  (value not drawn)  (no BOM)
TP14  Ø1.0mm,SMD  [TP_SMD_Ø1.0mm]  (value not drawn)  (no BOM)
TP15  Ø1.0mm,SMD  [TP_SMD_Ø1.0mm]  (value not drawn)  (no BOM)
TP16  Ø1.0mm,SMD  [TP_SMD_Ø1.0mm]  (value not drawn)  (no BOM)
U4  ADP536x  [BGA32C40P6X6_238X238X56]

### Blocks framed on the sheet
Li-Po: C7-C14 L1 L2 R1 R3 R5-R7 R10-R12 TP3 TP4 TP7 U4
MICRO USB CONECTOR: J3

### Ports
ADP_INT, I2C (harness I2C), Power (harness Power)

### Harnesses
I2C: SCL, SDA
Power: VBAT, 3.3VDD, 3.3VDDA, 1.8VDD

### Nets
1V8: C7.1 L1.2 R14.1 TP4.1 U4.D1(FB1) ; port Power.1.8VDD
3V3: C9.1 TP7.1 U4.A3(VOUT2) ; port Power.3.3VDD, port Power.3.3VDDA  [project net 3.3VDD]
BSNS: C14.1 SW2.1(N.C) TP13.1 U4.C6(BSNS) U4.D6(ISOB) ; port Power.VBAT  [also labelled VLi-Ion]
GND: C7.2 C8.2 C9.2 C10.2 C11.2 C12.2 C13.2 C14.2 C15.2 C16.2 J1.1 J3.2(D-) J3.3(D+) J3.4(ID) J3.5(GND) Q1.2(S) R10.1 R11.2 R12.2 R15.2 TP14.1 TP16.1 U4.A1(PGND2) U4.B2(AGND2) U4.F1(PGND1) U4.F4(AGND1)
VBUS: C13.1 SW1.1(N.C) TP11.1 U4.F6(VBUS)
VBUS': C15.1 C16.1 J3.1(VBUS) SW1.2(COM) TP12.1
VDD: C12.1 R3.2 U4.F5(VDD)
VIN1: C8.1 C10.1 C11.1 R1.1 R1.2 R5.1 R6.1 R7.1 R7.2 TP3.1 U4.C1(VIN2) U4.E6(VSYS) U4.F2(VIN1)  [also labelled VIN2, VSYS]
VLi-Ion': J1.3 SW2.2(COM) TP15.1
ADP_INT: U4.A6(~{INT}) ; port ADP_INT
EN1: R6.2 U4.E2(EN1)
EN2: R10.2 U4.B4(EN2)
ENCHG: R5.2 U4.F3(ENCHG)
ENSD: R11.1 U4.B3(ENSD)
ICS: R12.1 U4.D5(ILIM) U4.E5(ICS)
PGOOD1: R3.1 U4.B5(PGOOD1) U4.C5(PGOOD2) U4.E4(~{MR})  [also labelled PGOOD2]
SCL: U4.A4(SCL) ; port I2C.SCL  [project net PA9]
SDA: U4.A5(SDA) ; port I2C.SDA  [project net PA10]
SW1: L1.1 U4.E1(SW1)
SW2A: L2.1 U4.B1(SW2A)
SW2B: L2.2 U4.A2(SW2B)
THR: J1.2 U4.B6(THR)
VIDI: U4.D2(VID1)
NetQ1_1: Q1.1(G) R15.1 SW2.3(N.O)
NetQ1_3: Q1.3(D) R14.2

Not connected (* = marked no-connect by the designer): J3 6(Shield); SW1 3(N.O); U4 C2(STP)* E3(~{RESET})*

### Notes on the sheet
- Text
- SHARED BTW SHEETS
- ADP526X
- Fran Acién f.acien@upm.es
- Beatriz Martinez beatriz.martinez.herrero@alumnos.upm.es
- Labels drawn without touching a wire or pin: ILIM, MR

### Library data of the parts
C7-C11 C14 = 0402C-10UF-4V-X5R-SAM: CAPACITOR 0402 CERAMIC; Reel: C47
C12 = 0402C-1UF-25V-X5R-SAM: CAPACITOR 0402 CERAMIC; Reel: C49
C13 = 0402C-2U2-10V-X5R-SAM: CAPACITOR 0402 CERAMIC; Reel: C16
C15 = 0603C-10UF-10V-X5R-TDK: CAPACITOR 0603 CERAMIC; Manufacturer Part Number: C1608X5R0J106M; Manufacturer: TDK Corporation; Reel: C31; Supplier 1: Digi-Key; Supplier Part Number 1: 445-4112-2-ND
C16 = 0603C-100NF-25V-X7R-TDK: CAPACITOR 0603 CERAMIC; Manufacturer Part Number: C1608X7R1E104K; Manufacturer: TDK Corporation; Reel: C12; Supplier 1: Digi-Key; Supplier Part Number 1: 445-1316-2-ND
J1 = SM03B-SRSS-TB: 1.0mm pitch connector side entry SMD; Manufacturer: JST; Manufacturer Part Number: SM03B-SRSS-TB(LF)(SN); Part number IPS: 00000001785; Note: JST, Header; Artikkelnr Noca: N.A.; Part Number: SM03B-SRSS-TB; Footprint Doc: SM03B-SRSS-TB; LatestRevisionDate: 2017-10-09; Pin Count: 3; Publisher: Nordic Semiconductor; Published: 2017-10-09; Value: HDR-3, 1mm; ComponentLink1URL: *; ComponentLink1Description: Datasheet; ComponentLink2URL: *; ComponentLink2Description: Supplier link; HelpURL: http://www.jst-mfg.com/product/pdf/eng/eSH.pdf; Supplier 1: Digi-Key; Supplier Part Number 1: 455-1803-1-ND; Supplier 2: *; Supplier Part Number 2: *
J3 = MiniUSB-AB-SMT: MicroUSB-B-SMT; Manufacturer: Allen Creations Corp.; Manufacturer Part Number: AJU55-BS2111-L; Part number IPS: 00000007790; Artikkelnr Noca: 55029020; Part Number: USB-Micro-B-RA-SMD-PiP; Footprint Doc: USB-Micro-B-RA-SMD-PiP; LatestRevisionDate: 2016-04-21; Pin Count: 5; Publisher: Nordic Semiconductor; Published: 2014-10-07; Value: MicroUSB-B; Note: *; ComponentLink1URL: *; ComponentLink1Description: Datasheet; ComponentLink2URL: *; ComponentLink2Description: Supplier link; HelpURL: \\hizz\pro\app9717\Datasheet\connectores\Allen Creations Corp\AJU-211.pdf; Supplier 1: Cabcon; Supplier Part Number 1: AJU55-BS2111-L; Supplier 2: Digi-Key; Supplier Part Number 2: 609-4616-1-ND
L1 L2 = LQM2MPN4R7NG0L: Inductor Power Chip Shielded Multi-Layer 4.7uH 30% 1MHz Ferrite 1.1A 175mOhm DCR 0806 T/R; Package: None; Price: None; Value: *; MP: LQM2MPN4R7NG0L; Availability: Unavailable
Q1 = RV2C010UNT2L: N-Channel MOSFET, 20V, 1A, 470mOhm, 400mW; Manufacturer: Rohm Semiconductor; Part number IPS: N.A.; Artikkelnr Noca: 35010020; Part Number: RV2C010UNT2L; Manufacturer Part Number: RV2C010UNT2L; Footprint Doc: DFN-3; LatestRevisionDate: 2016-08-09; Publisher: Nordic Semiconductor; Published: 2016-08-09; Value: RV2C010UNT2L; Note: *; ComponentLink1URL: *; ComponentLink1Description: Datasheet; ComponentLink2URL: *; ComponentLink2Description: Supplier link; HelpURL: http://rohmfs.rohm.com/en/products/databook/datasheet/discrete/transistor/mosfet/rv2c010unt2l-e.pdf; Pin Count: 3; Supplier 1: Digi-Key; Supplier Part Number 1: RV2C010UNT2LCT-ND; Supplier 2: Mouser; Supplier Part Number 2: 755-RV2C010UNT2L
R1 R7 = 0603R-000: 2R2 Resistor
R3 R11 R12 = 0603R-10K: GENERIC RESISTOR 0603; Manufacturer: Stackpole Electronics Inc; Manufacturer Part Number: RMCF 1/16 10K 1% R; Tolerance: ±1%; Power (Watts): 0.1W, 1/10W; Temperature Coefficient: ±100ppm/°C; Resistance In Ohms: 10.0K; Reel: R21; Category: Resistors; Supplier Part Number: RMCF1/1610KFRDKR-ND; Lead Style: Surface Mount (SMD - SMT); RoHS: RoHS Compliant; Packaging: Digi-Reel®; Case: 0603 (1608 metric); Composition: Thick Film; Supplier: Digi-Key; Supplier 1: Digi-Key; Supplier Part Number 1: RMCF0603FT10K0DKR-ND
R5 = 0603R-000
R6 R10 = 0603R-1M: GENERIC RESISTOR 0603; Manufacturer: Stackpole Electronics Inc; Manufacturer Part Number: RMCF 1/16 1M 1% R; Power (Watts): 0.1W, 1/10W; Temperature Coefficient: ±100ppm/°C; Resistance In Ohms: 1.00M; Tolerance: ±1%; REEL: R51; Supplier: Digi-Key; Supplier Part Number: RMCF1/161MFRTR-ND; Category: Resistors; Lead Style: Surface Mount (SMD - SMT); Case: 0603 (1608 metric); RoHS: RoHS Compliant; Composition: Thick Film; Packaging: Tape & Reel (TR); Supplier 1: Digi-Key; Supplier Part Number 1: RMCF0603FT1M00TR-ND
R14 = 0603R-1K: as R18 on sheet connections; Supplier 1: Digi-Key; Supplier Part Number 1: RMCF0603FT1K00TR-ND
R15 = 0603R-10M: GENERIC RESISTOR 0603; Manufacturer Part Number: RMCF 1/16 10M 5% R; Manufacturer: Stackpole Electronics Inc; Reel: R15; Tolerance: ±5%; Temperature Coefficient: ±350ppm/°C; Power (Watts): 0.1W, 1/10W; Resistance In Ohms: 10.0M; Packaging: Tape & Reel (TR); Lead Style: Surface Mount (SMD - SMT); Case: 0603 (1608 metric); Features: -; Composition: Thick Film; RoHS: RoHS Compliant; Supplier: Digi-Key; Supplier Part Number: RMCF1/1610MJRTR-ND; Category: Resistors; Supplier 1: Digi-Key; Supplier Part Number 1: RMCF0603FT10M0DKR-ND
SW1 SW2 = AYZ0102AGRLC: Miniature slide switch, SPDT, Right-Angle, ON-ON, 12V, 100mA; Manufacturer: C&K; Artikkelnr Noca: N.A.; Part Number: AYZ0102AGRLC; Manufacturer Part Number: AYZ0102AGRLC; ComponentLink1URL: https://www.ckswitches.com/media/1431/ayz.pdf; ComponentLink1Description: Datasheet; ComponentLink2URL: *; ComponentLink2Description: Supplier link; Footprint Doc: AYZ0102AGRLC; LatestRevisionDate: 2019-05-08; Pin Count: 3; Publisher: Nordic Semiconductor; Published: 2019-05-08; Value: AYZ0102AGRLC; Note: *; Part number IPS: N.A.; Supplier 1: Digi-Key; Supplier Part Number 1: 401-2012-1-ND; Supplier 2: *; Supplier Part Number 2: *; HelpURL: https://www.ckswitches.com/media/1431/ayz.pdf
TP3 TP4 TP7 TP11-TP16 = TP_SMD_Ø1.0MM: as TP1 on sheet JTAG; Part Number: TP_SMD_Ø1.0MM; Manufacturer Part Number: *; ComponentLink1URL: *; ComponentLink1Description: Datasheet; ComponentLink2URL: *; ComponentLink2Description: Supplier link; HelpURL: *; Footprint Doc: TP_SMD_Ø1.0mm; LatestRevisionDate: 2013-06-11; Pin Count: 1; Publisher: Nordic Semiconductor; Published: 2013-06-11; Value: Ø1.0mm,SMD; Note: *; Supplier 1: *; Supplier Part Number 1: *; Supplier 2: *; Supplier Part Number 2: *; Part number IPS: N.A.
U4 = ADP536x: Advanced Battery Management PMIC With Ultralow Iq Buck and Buck-Boost; Manufacturer: Analog Devices; Part number IPS: 80000001823; Artikkelnr Noca: N.A.; Part Number: ADP536x; Manufacturer Part Number: ADP536x; ComponentLink1URL: *; ComponentLink1Description: Datasheet; ComponentLink2URL: *; ComponentLink2Description: Supplier link; HelpURL: *; Footprint Doc: WLCSP-32; LatestRevisionDate: 2019-03-25; Pin Count: 32; Publisher: Nordic Semiconductor; Published: 2019-03-25; Value: ADP536x; Note: *; Supplier 1: *; Supplier Part Number 1: *; Supplier 2: *; Supplier Part Number 2: *

## Nets that join several sheets
3.3VDD: connections (R16.1 R17.2), STM32WLE5CC (12 pins), Sensors (U3.2), JTAG (P1.1), ADP526X (C9.1 TP7.1 U4.A3)
BSNS: STM32WLE5CC (STM32.37), ADP526X (5 pins)
GND: connections (C27.2 Q2.E Q3.E RESET.2), STM32WLE5CC (32 pins), Sensors (15 pins), JTAG (P1.3 P1.5 P1.9), ADP526X (26 pins)
ADP_INT: STM32WLE5CC (STM32.16), ADP526X (U4.A6)
ADXL362_CS: STM32WLE5CC (STM32.14), Sensors (U1.8)
ADXL362_INT1: STM32WLE5CC (STM32.31), Sensors (U1.11)
ADXL372_CS: STM32WLE5CC (STM32.5), Sensors (U2.8)
ADXL372_INT1: STM32WLE5CC (STM32.34), Sensors (U2.11)
JTCK-SWCLK: STM32WLE5CC (STM32.42), JTAG (P1.4 TP2.1)
JTMS-SWDIO: STM32WLE5CC (STM32.36), JTAG (P1.2 TP1.1)
MISO: STM32WLE5CC (STM32.2), Sensors (U1.7 U2.7)
MOSI: STM32WLE5CC (STM32.3), Sensors (U1.6 U2.6)
NRST: connections (C27.1 RESET.1), STM32WLE5CC (STM32.18)
PA1: STM32WLE5CC (STM32.8), Sensors (U1.4 U2.4)
PA9: STM32WLE5CC (STM32.17), Sensors (U3.4), ADP526X (U4.A4)
PA10: STM32WLE5CC (STM32.33), Sensors (U3.3), ADP526X (U4.A5)
PB3: connections (R18.1), STM32WLE5CC (STM32.1)
PB6: connections (R19.1), STM32WLE5CC (STM32.4)